# Altium project CONTROLLER.PrjPcb (part 2 of 2)

## Sheet Isolator_Spi.SchDoc
size A4; SheetNumber: 14; SheetTotal: 16
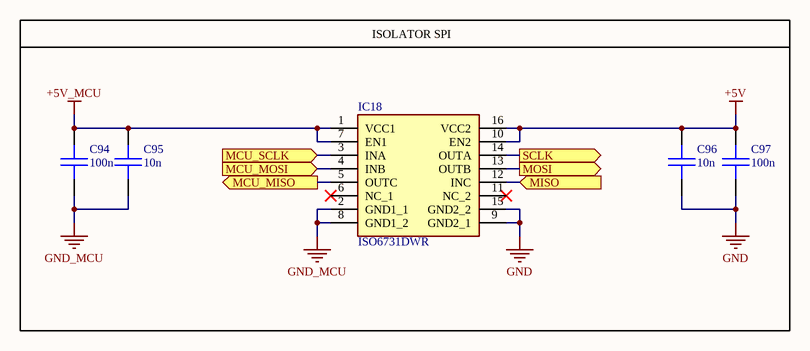
[diagram p14: Isolator_Spi.SchDoc]

### Parts
C94  100n  [C_0603]
C95  10n  [C_0603]
C96  10n  [C_0603]
C97  100n  [C_0603]
IC18  ISO6731DWR  [SOIC127P1030X265-16N]

### Blocks framed on the sheet
ISOLATOR SPI: C94-C97 IC18

### Ports
MCU_MISO (out, see Interconnections[5C], Microcontroller[4B]), MCU_MOSI (in, see Interconnections[5C], Microcontroller[4B]), MCU_SCLK (in, see Interconnections[5C], Microcontroller[4B]), MISO (in, see Interconnections[4C], AD_Converter[5A]), MOSI (out, see Interconnections[4C], AD_Converter[5A]), SCLK (out, see Interconnections[4C], AD_Converter[5A])

### Nets
+5V: C96.2 C97.2 IC18.10(EN2) IC18.16(VCC2)
+5V_MCU: C94.2 C95.2 IC18.1(VCC1) IC18.7(EN1)
GND: C96.1 C97.1 IC18.9(GND2_1) IC18.15(GND2_2)
GND_MCU: C94.1 C95.1 IC18.2(GND1_1) IC18.8(GND1_2)
MISO: IC18.12(INC) ; port MISO
MOSI: IC18.13(OUTB) ; port MOSI
SCLK: IC18.14(OUTA) ; port SCLK
NetIC17_46: IC18.3(INA) ; port MCU_SCLK
NetIC17_49: IC18.5(OUTC) ; port MCU_MISO
NetIC17_50: IC18.4(INB) ; port MCU_MOSI

Not connected (* = marked no-connect by the designer): IC18 6(NC_1)* 11(NC_2)*

### Library data of the parts
C94-C97 = CAP: SMD Chip Capacitor
IC18 = ISO6731DWR: Integrated Circuit; Manufacturer_Name: Texas Instruments; Datasheet Link: https://www.ti.com/lit/ds/symlink/iso6731.pdf?ts=1623477624400&ref_url=https%253A%252F%252Fwww.ti.com%252Fstore%252Fti%252Fen%252Fp%252Fproduct%252F%253Fp%253DISO6731DWR%2526keyMatch%253DISO6731DWR%2526tisearch%253Dsearch-everything%2526usecase%253DOPN; Height: 2.65mm; Manufacturer_Part_Number: ISO6731DWR; Mouser Part Number: 595-ISO6731DWR; Mouser Price/Stock: https://www.mouser.co.uk/ProductDetail/Texas-Instruments/ISO6731DWR?qs=iLbezkQI%252Bsg6BfGQOcJxyQ%3D%3D

## Sheet Isolator_I2C.SchDoc
size A4; SheetNumber: 15; SheetTotal: 16
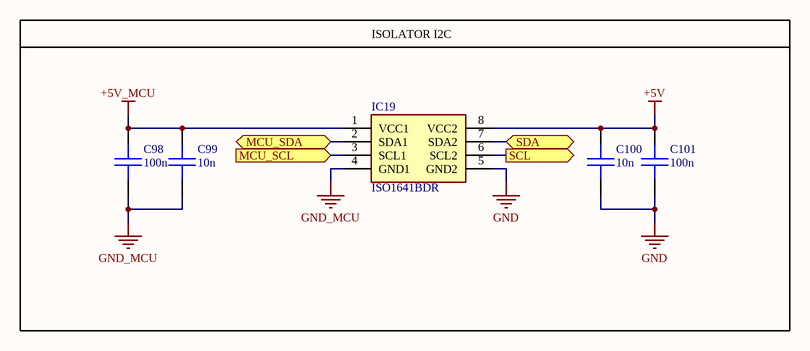
[diagram p15: Isolator_I2C.SchDoc]

### Parts
C98  100n  [C_0603]
C99  10n  [C_0603]
C100  10n  [C_0603]
C101  100n  [C_0603]
IC19  ISO1641BDR  [SOIC127P600X175-8N]

### Blocks framed on the sheet
ISOLATOR I2C: C98-C101 IC19

### Ports
MCU_SCL (in, see Interconnections[5A], Microcontroller[4A]), MCU_SDA (bidir, see Interconnections[5A], Microcontroller[4A]), SCL (out, see Interconnections[4A], Eeprom[1A], IO_Expander[2A]), SDA (bidir, see Interconnections[4A], Eeprom[1A], IO_Expander[2A])

### Nets
+5V: C100.2 C101.2 IC19.8(VCC2)
+5V_MCU: C98.2 C99.2 IC19.1(VCC1)
GND: C100.1 C101.1 IC19.5(GND2)
GND_MCU: C98.1 C99.1 IC19.4(GND1)
NetIC2_5: IC19.7(SDA2) ; port SDA
NetIC2_6: IC19.6(SCL2) ; port SCL
NetIC17_15: IC19.3(SCL1) ; port MCU_SCL
NetIC17_16: IC19.2(SDA1) ; port MCU_SDA

### Library data of the parts
C98-C101 = CAP: SMD Chip Capacitor
IC19 = ISO1641BDR: Integrated Circuit; Manufacturer_Name: Texas Instruments; Datasheet Link: https://www.ti.com/lit/ds/symlink/iso1641.pdf?ts=1621351593430&ref_url=https%253A%252F%252Fwww.ti.com%252Fisolation%252Fisolated-interfaces%252Fi2c%252Fproducts.html; Height: 1.75mm; Manufacturer_Part_Number: ISO1641BDR; Mouser Part Number: 595-ISO1641BDR; Mouser Price/Stock: https://www.mouser.co.uk/ProductDetail/Texas-Instruments/ISO1641BDR?qs=TuK3vfAjtkURaauWK%2F5e2g%3D%3D

## Sheet Isolator_SPWM.SchDoc
size A4; SheetNumber: 16; SheetTotal: 16
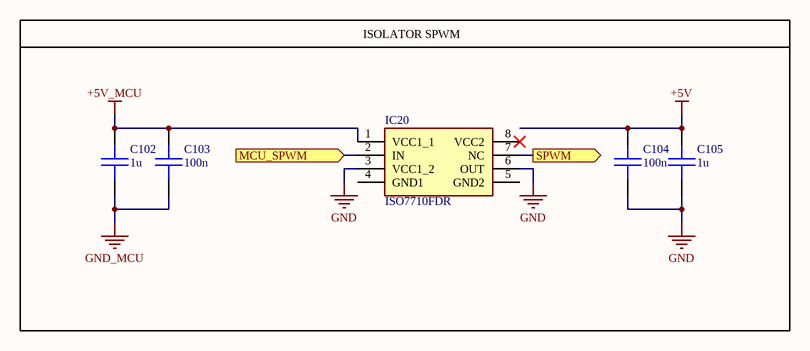
[diagram p16: Isolator_SPWM.SchDoc]

### Parts
C102  1u  [C_0603]
C103  100n  [C_0603]
C104  100n  [C_0603]
C105  1u  [C_0603]
IC20  ISO7710FDR  [SOIC127P600X175-8N]

### Blocks framed on the sheet
ISOLATOR SPWM: C102-C105 IC20

### Ports
MCU_SPWM (in, see Interconnections[5B], Microcontroller[4B]), SPWM (out, see Interconnections[4B], Feedback_Sensors[1A])

### Nets
+5V: C104.2 C105.2
+5V_MCU: C102.2 C103.2 IC20.1(VCC1_1)
GND: C104.1 C105.1 IC20.3(VCC1_2) IC20.6(OUT)
GND_MCU: C102.1 C103.1
NetC39_1: IC20.7(NC) ; port SPWM
NetIC17_45: IC20.2(IN) ; port MCU_SPWM

Not connected (* = marked no-connect by the designer): IC20 4(GND1) 5(GND2) 8(VCC2)*

### Library data of the parts
C102-C105 = CAP: SMD Chip Capacitor
IC20 = ISO7710FDR: Integrated Circuit; Manufacturer_Name: Texas Instruments; Datasheet Link: http://www.ti.com/lit/gpn/iso7710; Height: 1.75mm; Manufacturer_Part_Number: ISO7710FDR; Mouser Part Number: 595-ISO7710FDR; Mouser Price/Stock: https://www.mouser.co.uk/ProductDetail/Texas-Instruments/ISO7710FDR?qs=0C8XhJW8e4r482bmRgamQA%3D%3D; Arrow Part Number: ISO7710FDR; Arrow Price/Stock: https://www.arrow.com/en/products/iso7710fdr/texas-instruments?region=nac

## Nets that join several sheets
+3V3: Power (C17.1 LD2.2 LD2.4), Eeprom (C21.1 C22.1 IC2.8), IO_Expander (R15.2 R17.2 R19.2), Feedback_Sensors (14 pins), AD_Converter (C63.2 C64.2 IC11.10), Main_Connector (J5.10)
+3V3_MCU: Power (C20.1 LD3.2 LD3.4), Microcontroller (14 pins)
+5V: Power (6 pins), IO_Expander (8 pins), Communications (C35.1 C36.1 IC4.8), Feedback_Sensors (13 pins), Gate_Drivers (9 pins), Isolator_Gate_Driver (C85.2 C86.2 IC16.16), Isolator_Spi (C96.2 C97.2 IC18.10 IC18.16), Isolator_I2C (C100.2 C101.2 IC19.8), Isolator_SPWM (C104.2 C105.2)
+5V_MCU: Power (C18.1 C19.1 LD3.3), Communications (C34.2 C37.1 IC4.1), Isolator_Gate_Driver (C83.2 C84.2 IC16.1), Isolator_Spi (C94.2 C95.2 IC18.1 IC18.7), Isolator_I2C (C98.2 C99.2 IC19.1), Isolator_SPWM (C102.2 C103.2 IC20.1)
+12V: Power (9 pins), Load_Switches (6 pins), Feedback_Sensors (5 pins), Gate_Drivers (12 pins)
+12V_IN: Power (D1.2), Main_Connector (J5.1 J5.2 J5.3 J5.4)
GND: Power (20 pins), Eeprom (6 pins), Load_Switches (14 pins), IO_Expander (12 pins), Communications (C35.2 C36.2 D9.3 IC4.5), Feedback_Sensors (31 pins), AD_Converter (12 pins), Gate_Drivers (21 pins), Isolator_Gate_Driver (C85.1 C86.1 IC16.9), Main_Connector (7 pins), Isolator_Spi (C96.1 C97.1 IC18.9 IC18.15), Isolator_I2C (C100.1 C101.1 IC19.5), Isolator_SPWM (C104.1 C105.1 IC20.3 IC20.6)
GND_MCU: Power (C18.2 C19.2 C20.2 LD3.1), Communications (C34.1 C37.2 IC4.4 K1.2), Feedback_Sensors (8 pins), Isolator_Gate_Driver (C83.1 C84.1 IC16.8), Microcontroller (13 pins), Isolator_Spi (C94.1 C95.1 IC18.2 IC18.8), Isolator_I2C (C98.1 C99.1 IC19.4), Isolator_SPWM (C102.1 C103.1)
MISO: AD_Converter (IC11.12 IC12.7), Isolator_Spi (IC18.12)
MOSI: AD_Converter (IC11.14 IC12.6), Isolator_Spi (IC18.13)
NetC31_1: IO_Expander (C31.1 D6.1 R15.1 R16.2), Main_Connector (J5.7)
NetC32_1: IO_Expander (C32.1 D7.1 R17.1 R18.2), Main_Connector (J5.8)
NetC33_1: IO_Expander (C33.1 D8.1 R19.1 R20.2), Main_Connector (J5.9)
NetC38_1: Feedback_Sensors (C38.1 IC5.16 R23.1 R35.2), Main_Connector (J5.33)
NetC39_1: Feedback_Sensors (C39.1), Isolator_SPWM (IC20.7)
NetC45_1: Feedback_Sensors (C45.1 IC5.2 R36.1), Main_Connector (J5.32)
NetC53_1: Feedback_Sensors (C53.1 D10.3 IC10.1 R44.1), AD_Converter (IC12.5)
NetC55_1: Feedback_Sensors (C55.1 D11.3 IC10.7 R49.1), AD_Converter (IC12.4)
NetC74_1: Gate_Drivers (C74.1 IC13.6), Headers (J4.1)
NetC75_1: Gate_Drivers (C75.1 IC14.6), Headers (J4.3)
NetC76_1: Gate_Drivers (C76.1 IC15.6), Headers (J4.5)
NetD2_2: Load_Switches (D2.2 D3.1 Q3.3), Main_Connector (J5.5)
NetD4_2: Load_Switches (D4.2 D5.1 Q6.3), Main_Connector (J5.6)
NetD9_1: Communications (D9.1 IC4.7 R21.2), Main_Connector (J5.14)
NetD9_2: Communications (D9.2 IC4.6 K1.4), Main_Connector (J5.13)
NetD12_1: AD_Converter (D12.1 R54.2), Main_Connector (J5.11)
NetIC2_5: Eeprom (IC2.5), IO_Expander (IC3.13), Isolator_I2C (IC19.7)
NetIC2_6: Eeprom (IC2.6), IO_Expander (IC3.12), Isolator_I2C (IC19.6)
NetIC2_7: Eeprom (IC2.7), IO_Expander (IC3.9)
NetIC3_5: Load_Switches (R4.1), IO_Expander (IC3.5)
NetIC3_7: Load_Switches (R9.1), IO_Expander (IC3.7)
NetIC3_8: IO_Expander (IC3.8), AD_Converter (IC11.11)
NetIC3_10: IO_Expander (IC3.10), AD_Converter (IC12.1)
NetIC4_2: Communications (IC4.2), Microcontroller (IC17.20)
NetIC4_3: Communications (IC4.3), Microcontroller (IC17.21)
NetIC6_3: Feedback_Sensors (IC6.3 R25.2 R32.1), Main_Connector (J5.22)
NetIC6_4: Feedback_Sensors (IC6.4 R26.2 R33.1), Main_Connector (J5.23)
NetIC6_5: Feedback_Sensors (IC6.5 R27.2 R34.1), Main_Connector (J5.24)
NetIC6_12: Feedback_Sensors (IC6.12), Microcontroller (IC17.41)
NetIC6_13: Feedback_Sensors (IC6.13), Microcontroller (IC17.23)
NetIC6_14: Feedback_Sensors (IC6.14), Microcontroller (IC17.22)
NetIC8_3: Feedback_Sensors (IC8.3 R37.2 R41.1), Main_Connector (J5.25)
NetIC8_4: Feedback_Sensors (IC8.4 R38.2 R42.1), Main_Connector (J5.26)
NetIC8_5: Feedback_Sensors (IC8.5 R39.2 R43.1), Main_Connector (J5.27)
NetIC8_12: Feedback_Sensors (IC8.12), Microcontroller (IC17.44)
NetIC8_13: Feedback_Sensors (IC8.13), Microcontroller (IC17.43)
NetIC8_14: Feedback_Sensors (IC8.14), Microcontroller (IC17.42)
NetIC11_1: AD_Converter (IC11.1), Headers (J1.3)
NetIC11_2: AD_Converter (IC11.2), Headers (J1.5)
NetIC11_3: AD_Converter (IC11.3), Headers (J1.6)
NetIC11_4: AD_Converter (IC11.4), Headers (J2.1)
NetIC11_5: AD_Converter (IC11.5), Headers (J2.3)
NetIC11_6: AD_Converter (IC11.6), Headers (J2.5)
NetIC11_16: AD_Converter (IC11.16), Headers (J1.1)
NetIC13_1: Gate_Drivers (IC13.1), Headers (J3.3)
NetIC13_8: Gate_Drivers (IC13.8), Headers (J3.1)
NetIC13_12: Gate_Drivers (IC13.12), Isolator_Gate_Driver (IC16.15)
NetIC13_14: Gate_Drivers (IC13.14), Isolator_Gate_Driver (IC16.14)
NetIC14_1: Gate_Drivers (IC14.1), Headers (J3.2)
NetIC14_8: Gate_Drivers (IC14.8), Headers (J3.5)
NetIC14_12: Gate_Drivers (IC14.12), Isolator_Gate_Driver (IC16.13)
NetIC14_14: Gate_Drivers (IC14.14), Isolator_Gate_Driver (IC16.12)
NetIC15_1: Gate_Drivers (IC15.1), Headers (J3.6)
NetIC15_8: Gate_Drivers (IC15.8), Headers (J3.4)
NetIC15_12: Gate_Drivers (IC15.12), Isolator_Gate_Driver (IC16.11)
NetIC15_14: Gate_Drivers (IC15.14), Isolator_Gate_Driver (IC16.10)
NetIC16_2: Isolator_Gate_Driver (IC16.2), Microcontroller (IC17.26)
NetIC16_3: Isolator_Gate_Driver (IC16.3), Microcontroller (IC17.27)
NetIC16_4: Isolator_Gate_Driver (IC16.4), Microcontroller (IC17.28)
NetIC16_5: Isolator_Gate_Driver (IC16.5), Microcontroller (IC17.55)
NetIC16_6: Isolator_Gate_Driver (IC16.6), Microcontroller (IC17.56)
NetIC16_7: Isolator_Gate_Driver (IC16.7), Microcontroller (IC17.57)
NetIC17_15: Microcontroller (IC17.15), Isolator_I2C (IC19.3)
NetIC17_16: Microcontroller (IC17.16), Isolator_I2C (IC19.2)
NetIC17_17: Communications (R22.2), Microcontroller (IC17.17)
NetIC17_45: Microcontroller (IC17.45), Isolator_SPWM (IC20.2)
NetIC17_46: Microcontroller (IC17.46), Isolator_Spi (IC18.3)
NetIC17_49: Microcontroller (IC17.49), Isolator_Spi (IC18.5)
NetIC17_50: Microcontroller (IC17.50), Isolator_Spi (IC18.4)
NetJ5_28: Feedback_Sensors (R45.2 R46.2), Main_Connector (J5.28)
NetJ5_29: Feedback_Sensors (R46.1 R47.2), Main_Connector (J5.29)
NetJ5_30: Feedback_Sensors (R50.2 R51.2), Main_Connector (J5.30)
NetJ5_31: Feedback_Sensors (R51.1 R52.2), Main_Connector (J5.31)
SCLK: AD_Converter (IC11.13 IC12.8), Isolator_Spi (IC18.14)